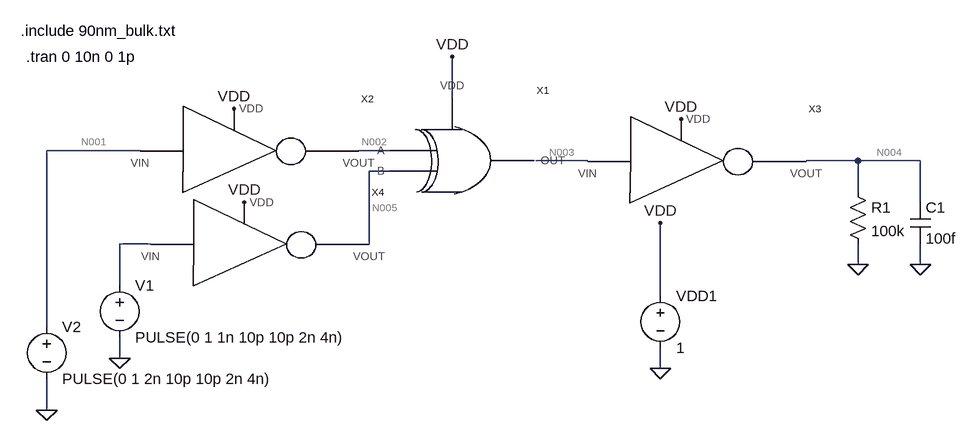
[diagram p0: schematic task_2.asc]
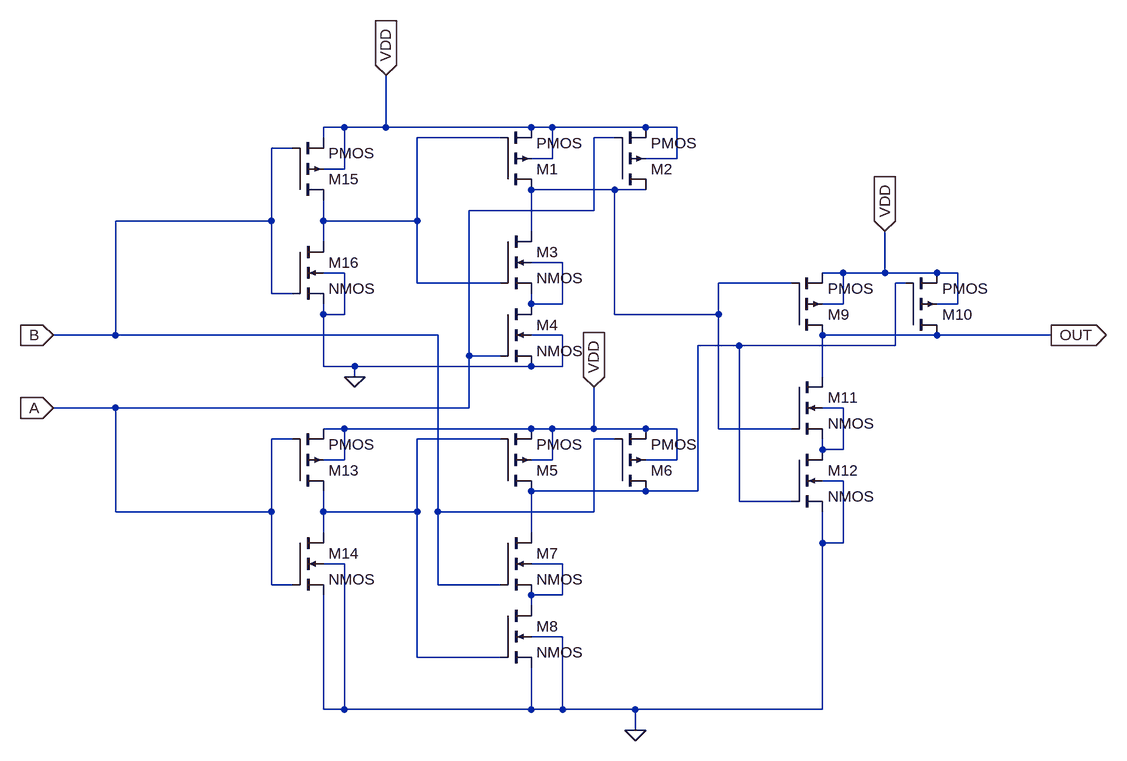
[diagram p1: sub-circuit xor.asc]
task_2.asc, the LTspice schematic file:
Version 4
SHEET 1 880 680
WIRE -16 80 -16 16
WIRE -496 160 -640 160
WIRE -112 160 -160 160
WIRE 192 176 112 176
WIRE 608 176 528 176
WIRE 704 176 608 176
WIRE -112 192 -144 192
WIRE 608 224 608 176
WIRE 704 240 704 176
WIRE -480 304 -528 304
WIRE -144 304 -144 192
WIRE 608 336 608 304
WIRE 704 336 704 304
WIRE -528 368 -528 304
WIRE 304 384 304 272
WIRE -640 432 -640 160
WIRE -528 480 -528 448
WIRE 304 496 304 464
WIRE -640 560 -640 512
FLAG -16 16 VDD
FLAG 304 272 VDD
FLAG 304 496 0
FLAG -640 560 0
FLAG -528 480 0
FLAG 608 336 0
FLAG 704 336 0
FLAG -352 96 VDD
FLAG -336 240 VDD
FLAG 336 112 VDD
SYMBOL xor -16 176 R0
SYMATTR InstName X1
SYMBOL voltage 304 368 R0
WINDOW 123 0 0 Left 2
WINDOW 39 0 0 Left 2
SYMATTR InstName VDD1
SYMATTR Value 1
SYMBOL voltage -640 416 R0
WINDOW 123 0 0 Left 2
WINDOW 39 0 0 Left 2
SYMATTR InstName V2
SYMATTR Value PULSE(0 1 2n 10p 10p 2n 4n)
SYMBOL voltage -528 352 R0
WINDOW 123 0 0 Left 2
WINDOW 39 0 0 Left 2
SYMATTR InstName V1
SYMATTR Value PULSE(0 1 1n 10p 10p 2n 4n)
SYMBOL res 592 208 R0
SYMATTR InstName R1
SYMATTR Value 100k
SYMBOL cap 688 240 R0
SYMATTR InstName C1
SYMATTR Value 100f
SYMBOL inverter -368 160 R0
SYMATTR InstName X2
SYMBOL inverter 320 176 R0
SYMATTR InstName X3
SYMBOL inverter -352 304 R0
SYMATTR InstName X4
TEXT -672 16 Left 2 !.tran 0 10n 0 1p
TEXT -680 -24 Left 2 !.include 90nm_bulk.txt

xor.asc, the sub-circuit schematic file:
Version 4
SHEET 1 880 852
WIRE -688 -96 -720 -96
WIRE -624 -96 -624 -176
WIRE -624 -96 -688 -96
WIRE -400 -96 -624 -96
WIRE -368 -96 -400 -96
WIRE -224 -96 -368 -96
WIRE -176 -96 -224 -96
WIRE -720 -80 -720 -96
WIRE -448 -80 -576 -80
WIRE -272 -80 -304 -80
WIRE -768 -64 -800 -64
WIRE -368 -48 -368 -96
WIRE -368 -48 -400 -48
WIRE -176 -48 -176 -96
WIRE -176 -48 -224 -48
WIRE -688 -32 -688 -96
WIRE -688 -32 -720 -32
WIRE -272 0 -400 0
WIRE -224 0 -272 0
WIRE -304 32 -304 -80
WIRE -304 32 -496 32
WIRE -800 48 -800 -64
WIRE -800 48 -1040 48
WIRE -720 48 -720 16
WIRE -576 48 -576 -80
WIRE -576 48 -720 48
WIRE -400 64 -400 0
WIRE -720 80 -720 48
WIRE -352 112 -400 112
WIRE -688 128 -720 128
WIRE 80 128 48 128
WIRE 144 128 144 64
WIRE 144 128 80 128
WIRE 224 128 144 128
WIRE 256 128 224 128
WIRE -576 144 -576 48
WIRE -448 144 -576 144
WIRE 0 144 -112 144
WIRE 176 144 160 144
WIRE -800 160 -800 48
WIRE -768 160 -800 160
WIRE -400 176 -400 160
WIRE -352 176 -352 112
WIRE -352 176 -400 176
WIRE 80 176 80 128
WIRE 80 176 48 176
WIRE 256 176 256 128
WIRE 256 176 224 176
WIRE -720 192 -720 176
WIRE -688 192 -688 128
WIRE -688 192 -720 192
WIRE -272 192 -272 0
WIRE -112 192 -112 144
WIRE -112 192 -272 192
WIRE -1040 224 -1040 48
WIRE -1040 224 -1136 224
WIRE -544 224 -1040 224
WIRE -352 224 -400 224
WIRE 224 224 48 224
WIRE 400 224 224 224
WIRE -80 240 -144 240
WIRE 160 240 160 144
WIRE 160 240 -80 240
WIRE -496 256 -496 32
WIRE -448 256 -496 256
WIRE -720 272 -720 192
WIRE -672 272 -720 272
WIRE -400 272 -672 272
WIRE -352 272 -352 224
WIRE -352 272 -400 272
WIRE -672 288 -672 272
WIRE 48 288 48 224
WIRE -1040 336 -1136 336
WIRE -496 336 -496 256
WIRE -496 336 -1040 336
WIRE 80 336 48 336
WIRE -688 368 -720 368
WIRE -400 368 -688 368
WIRE -368 368 -400 368
WIRE -304 368 -304 304
WIRE -304 368 -368 368
WIRE -224 368 -304 368
WIRE -176 368 -224 368
WIRE -112 368 -112 192
WIRE 0 368 -112 368
WIRE -768 384 -800 384
WIRE -448 384 -576 384
WIRE -272 384 -304 384
WIRE 48 400 48 384
WIRE 80 400 80 336
WIRE 80 400 48 400
WIRE -688 416 -688 368
WIRE -688 416 -720 416
WIRE -368 416 -368 368
WIRE -368 416 -400 416
WIRE -176 416 -176 368
WIRE -176 416 -224 416
WIRE 80 448 48 448
WIRE -224 464 -400 464
WIRE -144 464 -144 240
WIRE -144 464 -224 464
WIRE -80 480 -80 240
WIRE 0 480 -80 480
WIRE -1040 496 -1040 336
WIRE -800 496 -800 384
WIRE -800 496 -1040 496
WIRE -720 496 -720 464
WIRE -576 496 -576 384
WIRE -576 496 -720 496
WIRE -544 496 -544 224
WIRE -304 496 -304 384
WIRE -304 496 -544 496
WIRE -720 528 -720 496
WIRE -400 528 -400 464
WIRE 48 544 48 496
WIRE 80 544 80 448
WIRE 80 544 48 544
WIRE -688 576 -720 576
WIRE -352 576 -400 576
WIRE -800 608 -800 496
WIRE -768 608 -800 608
WIRE -544 608 -544 496
WIRE -448 608 -544 608
WIRE -352 624 -352 576
WIRE -352 624 -400 624
WIRE -400 640 -400 624
WIRE -352 688 -400 688
WIRE -576 720 -576 496
WIRE -448 720 -576 720
WIRE -720 800 -720 624
WIRE -688 800 -688 576
WIRE -688 800 -720 800
WIRE -400 800 -400 736
WIRE -400 800 -688 800
WIRE -352 800 -352 688
WIRE -352 800 -400 800
WIRE -240 800 -352 800
WIRE 48 800 48 544
WIRE 48 800 -240 800
WIRE -240 832 -240 800
FLAG -1136 336 A
IOPIN -1136 336 In
FLAG -1136 224 B
IOPIN -1136 224 In
FLAG 400 224 OUT
IOPIN 400 224 Out
FLAG -624 -176 VDD
IOPIN -624 -176 In
FLAG -304 304 VDD
IOPIN -304 304 In
FLAG 144 64 VDD
IOPIN 144 64 In
FLAG -672 288 0
FLAG -240 832 0
SYMBOL pmos4 -448 0 M180
SYMATTR InstName M1
SYMBOL pmos4 -272 0 M180
SYMATTR InstName M2
SYMBOL nmos4 -448 64 R0
SYMATTR InstName M3
SYMBOL nmos4 -448 176 R0
SYMATTR InstName M4
SYMBOL pmos4 -448 464 M180
SYMATTR InstName M5
SYMBOL pmos4 -272 464 M180
SYMATTR InstName M6
SYMBOL nmos4 -448 528 R0
SYMATTR InstName M7
SYMBOL nmos4 -448 640 R0
SYMATTR InstName M8
SYMBOL pmos4 0 224 M180
SYMATTR InstName M9
SYMBOL pmos4 176 224 M180
SYMATTR InstName M10
SYMBOL nmos4 0 288 R0
SYMATTR InstName M11
SYMBOL nmos4 0 400 R0
SYMATTR InstName M12
SYMBOL pmos4 -768 464 M180
SYMATTR InstName M13
SYMBOL nmos4 -768 528 R0
SYMATTR InstName M14
SYMBOL pmos4 -768 16 M180
SYMATTR InstName M15
SYMBOL nmos4 -768 80 R0
SYMATTR InstName M16

The netlist it stands for:
* task_2.asc
XX1 N002 N005 N003 VDD xor
VDD1 VDD 0 1
V2 N001 0 PULSE(0 1 2n 10p 10p 2n 4n)
V1 N006 0 PULSE(0 1 1n 10p 10p 2n 4n)
R1 N004 0 100k
C1 N004 0 100f
XX2 N001 N002 VDD inverter  ; pins VIN VOUT VDD
XX3 N003 N004 VDD inverter  ; pins VIN VOUT VDD
XX4 N006 N005 VDD inverter  ; pins VIN VOUT VDD

* block symbol definitions
.subckt xor A B OUT VDD
M1 N002 N001 VDD VDD PMOS
M2 N002 A VDD VDD PMOS
M3 N002 N001 N003 N003 NMOS
M4 N003 A 0 0 NMOS
M5 N004 N006 VDD VDD PMOS
M6 N004 B VDD VDD PMOS
M7 N004 B N007 N007 NMOS
M8 N007 N006 0 0 NMOS
M9 OUT N002 VDD VDD PMOS
M10 OUT N004 VDD VDD PMOS
M11 OUT N002 N005 N005 NMOS
M12 N005 N004 0 0 NMOS
M13 N006 A VDD VDD PMOS
M14 N006 A 0 0 NMOS
M15 N001 B VDD VDD PMOS
M16 N001 B 0 0 NMOS
.ends xor

.model NMOS NMOS
.model PMOS PMOS
.lib standard.mos
.tran 0 10n 0 1p
.include 90nm_bulk.txt
.backanno
.end

* Results of the author's LTspice run, read from the files saved beside the schematic
* Operating Point, zero values left out:
*   V(n005) = 1 V
*   V(vdd) = 1 V
*   V(n002) = 999.8 mV
*   V(n003) = 156.3 µV
*   V(n004) = 972.5 mV
*   I(R1) = 9.725 µA
*   I(V1) = 130.9 pA
*   I(V2) = 130.8 pA
*   I(Vdd1) = -9.806 µA
*   Ix(x1:A) = 49.4 nA
*   Ix(x1:B) = 1.099 nA
*   Ix(x1:OUT) = 110.3 pA
*   Ix(x1:VDD) = 14.89 nA
*   Ix(x2:VIN) = -130.8 pA
*   Ix(x2:VOUT) = -49.4 nA
*   Ix(x2:VDD) = 54.64 nA
*   Ix(x3:VIN) = -110.3 pA
*   Ix(x3:VOUT) = -9.725 µA
*   Ix(x3:VDD) = 9.73 µA
*   Ix(x4:VIN) = -130.9 pA
*   Ix(x4:VOUT) = -1.099 nA
*   Ix(x4:VDD) = 6.34 nA
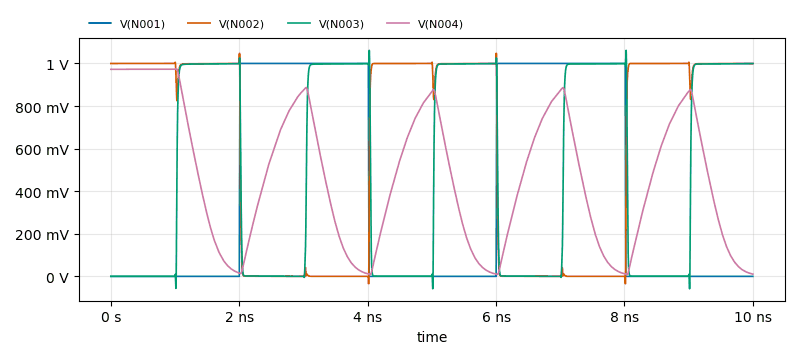
[diagram p2: Transient Analysis of task_2.asc, plotted from the saved traces]
* Transient Analysis, 1 run:
*   V(N001): min 0 V, max 1 V, average 402 mV, rms 633.5 mV, last 0 V
*   V(N002): min -35.24 mV, max 1.048 V, average 596.7 mV, rms 769.8 mV, last 999.7 mV
*   V(N003): min -58.43 mV, max 1.061 V, average 494 mV, rms 697.7 mV, last 999.4 mV
*   V(N004): min 8.119 mV, max 973.7 mV, average 467.5 mV, rms 572.5 mV, last 10.34 mV